# EasyEDA Pro project ProProject_aDataFlow_v2_pub_2024-01-13.epro, schematic SCH_front_1
Create Date: 2023-10-16; Page Name: P1; Project Name: aDataFlow_v2_pub; Schematic Name: SCH_front_1; Update Date: 2023-12-25; Company: AMAGSTY; Drawed: amagsty; Page Size: -; Part Number: -; Reviewed: -; Version: 2.51
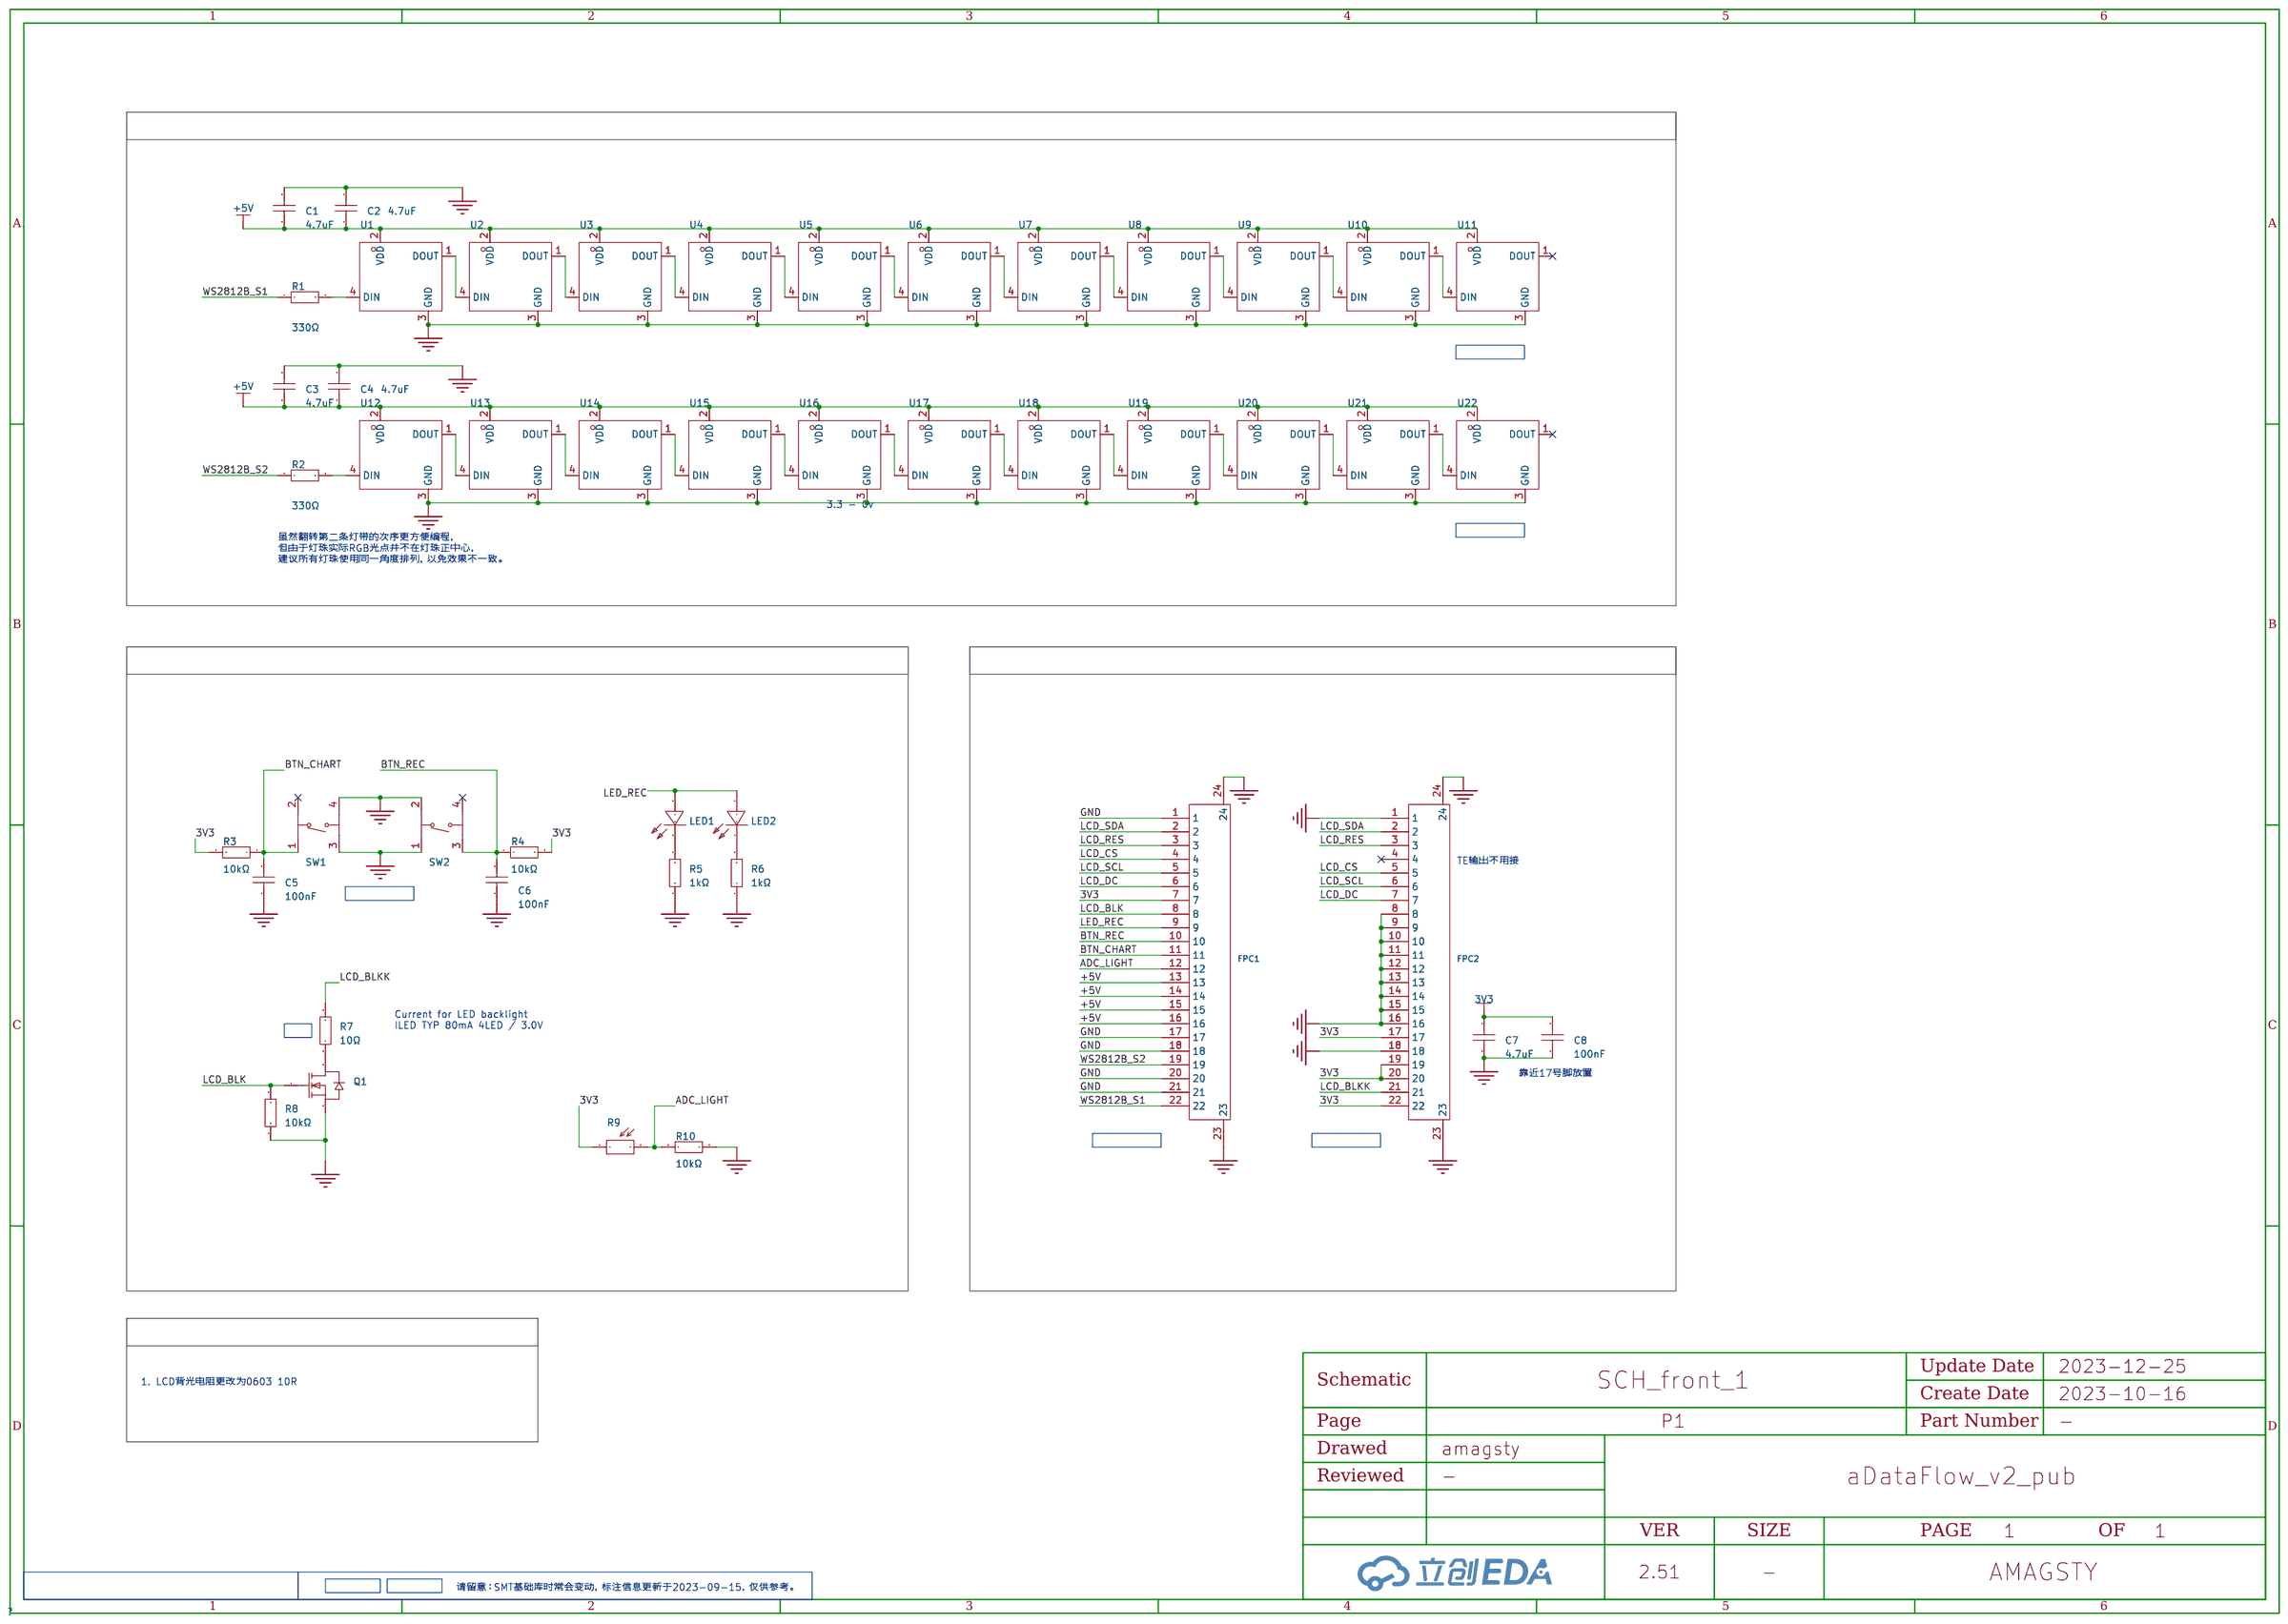
[diagram p4: schematic sheet]

## Parts
C1  4.7uF  [C0402]
C2  4.7uF  [C0402]
C3  4.7uF  [C0402]
C4  4.7uF  [C0402]
C5  100nF  [C0402]
C6  100nF  [C0402]
C7  4.7uF  [C0402]
C8  100nF  [C0402]
FPC1  AFC01-S22FCA-00  [FPC-SMD_P0.5-22P_FGS-XJ-H2.0]
FPC2  AFC01-S22FCA-00  [FPC-SMD_P0.5-22P_FGS-XJ-H2.0]
LED1  KT-0603R  [LED0603-RD]
LED2  KT-0603R  [LED0603-RD]
Q1  AO3400A  [SOT-23-3_L2.9-W1.6-P1.90-LS2.8-BR]
R1  330Ω  [R0402]
R2  330Ω  [R0402]
R3  10kΩ  [R0402]
R4  10kΩ  [R0402]
R5  1kΩ  [R0402]
R6  1kΩ  [R0402]
R7  10Ω  [R0603]
R8  10kΩ  [R0402]
R9  GT36516  [RES-SMD_L3.6-W2.4]
R10  10kΩ  [R0402]
SW1  TS-1187A-B-A-B  [SW-SMD_4P-L5.1-W5.1-P3.70-LS6.5-TL-2]
SW2  TS-1187A-B-A-B  [SW-SMD_4P-L5.1-W5.1-P3.70-LS6.5-TL-2]
U1  XL-1010RGBC-WS2812B  [LED-SMD_4P-L1.0-W1.0-TL_XL-1010RGBC-WS2812B]
U2  XL-1010RGBC-WS2812B  [LED-SMD_4P-L1.0-W1.0-TL_XL-1010RGBC-WS2812B]
U3  XL-1010RGBC-WS2812B  [LED-SMD_4P-L1.0-W1.0-TL_XL-1010RGBC-WS2812B]
U4  XL-1010RGBC-WS2812B  [LED-SMD_4P-L1.0-W1.0-TL_XL-1010RGBC-WS2812B]
U5  XL-1010RGBC-WS2812B  [LED-SMD_4P-L1.0-W1.0-TL_XL-1010RGBC-WS2812B]
U6  XL-1010RGBC-WS2812B  [LED-SMD_4P-L1.0-W1.0-TL_XL-1010RGBC-WS2812B]
U7  XL-1010RGBC-WS2812B  [LED-SMD_4P-L1.0-W1.0-TL_XL-1010RGBC-WS2812B]
U8  XL-1010RGBC-WS2812B  [LED-SMD_4P-L1.0-W1.0-TL_XL-1010RGBC-WS2812B]
U9  XL-1010RGBC-WS2812B  [LED-SMD_4P-L1.0-W1.0-TL_XL-1010RGBC-WS2812B]
U10  XL-1010RGBC-WS2812B  [LED-SMD_4P-L1.0-W1.0-TL_XL-1010RGBC-WS2812B]
U11  XL-1010RGBC-WS2812B  [LED-SMD_4P-L1.0-W1.0-TL_XL-1010RGBC-WS2812B]
U12  XL-1010RGBC-WS2812B  [LED-SMD_4P-L1.0-W1.0-TL_XL-1010RGBC-WS2812B]
U13  XL-1010RGBC-WS2812B  [LED-SMD_4P-L1.0-W1.0-TL_XL-1010RGBC-WS2812B]
U14  XL-1010RGBC-WS2812B  [LED-SMD_4P-L1.0-W1.0-TL_XL-1010RGBC-WS2812B]
U15  XL-1010RGBC-WS2812B  [LED-SMD_4P-L1.0-W1.0-TL_XL-1010RGBC-WS2812B]
U16  XL-1010RGBC-WS2812B  [LED-SMD_4P-L1.0-W1.0-TL_XL-1010RGBC-WS2812B]
U17  XL-1010RGBC-WS2812B  [LED-SMD_4P-L1.0-W1.0-TL_XL-1010RGBC-WS2812B]
U18  XL-1010RGBC-WS2812B  [LED-SMD_4P-L1.0-W1.0-TL_XL-1010RGBC-WS2812B]
U19  XL-1010RGBC-WS2812B  [LED-SMD_4P-L1.0-W1.0-TL_XL-1010RGBC-WS2812B]
U20  XL-1010RGBC-WS2812B  [LED-SMD_4P-L1.0-W1.0-TL_XL-1010RGBC-WS2812B]
U21  XL-1010RGBC-WS2812B  [LED-SMD_4P-L1.0-W1.0-TL_XL-1010RGBC-WS2812B]
U22  XL-1010RGBC-WS2812B  [LED-SMD_4P-L1.0-W1.0-TL_XL-1010RGBC-WS2812B]

## Library data of the parts
C1-C4 C7 = CL05A475MP5NRNC: 容值:4.7uF;精度:±20%;额定电压:10V;材质(温度系数):X5R;; LCSC Part Name: 4.7uF ±20% 10V; Supplier Part: C23733; Manufacturer: SAMSUNG(三星); Supplier Footprint: 0402; JLCPCB Part Class: 基础库; Datasheet: https://atta.szlcsc.com/upload/public/pdf/source/20160103/1457707710457.pdf; Supplier: LCSC; Tolerance: ±20%; Voltage Rated: 10V; Temperature Coefficient: X5R
C5 C6 C8 = CL05B104KO5NNNC: 容值:100nF;精度:±10%;额定电压:16V;材质(温度系数):X7R;; LCSC Part Name: 100nF ±10% 16V; Supplier Part: C1525; Manufacturer: SAMSUNG(三星); Supplier Footprint: 0402; JLCPCB Part Class: 基础库; Datasheet: https://atta.szlcsc.com/upload/public/pdf/source/20160103/1457707674891.pdf; Supplier: LCSC; Tolerance: ±10%; Voltage Rated: 16V; Temperature Coefficient: X7R
FPC1 FPC2 = AFC01-S22FCA-00: 间距:0.5mm;触点数量:22;锁定特性:翻盖式;安装类型:卧贴;触点类型:下接;; LCSC Part Name: FPC 0.5MM 22P 翻盖式 H2.0mm 下接; Supplier Part: C262668; Manufacturer: JS(钜硕电子); Supplier Footprint: P=0.5mm; JLCPCB Part Class: 扩展库; Supplier: LCSC; Pitch: 0.5mm; Number of Contacts: 22; Locking Feature: 翻盖式; Mounting Type: 卧贴; Contact Type: 下接; Height Above Board: 2mm; FFC, FCB Thickness: 0.3mm~0.3mm
LED1 LED2 = KT-0603R: 发光颜色:红灯;二极管配置:-;透镜颜色:-;主波长:-;色温:-;功率:-;发光角度:-;安装方式:-;工作温度:-40℃~+85℃;; LCSC Part Name: 0603 红灯 高亮; Supplier Part: C2286; Manufacturer: KENTO; Supplier Footprint: 0603; JLCPCB Part Class: 基础库; Datasheet: https://atta.szlcsc.com/upload/public/pdf/source/20160616/1466072038404.pdf; Supplier: LCSC; Emitted Color: 红灯; Operating Temperature: -40℃~+85℃
Q1 = AO3400A_C20917: 类型:N沟道;漏源电压(Vdss):30V;连续漏极电流(Id):5.7A;功率(Pd):1.4W;导通电阻(RDS(on)@Vgs,Id):26.5mΩ@10V,5.7A;; LCSC Part Name: N沟道 30V 5.7A; Supplier Part: C20917; Manufacturer: AOS; Supplier Footprint: SOT-23-3L; JLCPCB Part Class: Basic Part; Datasheet: https://atta.szlcsc.com/upload/public/pdf/source/20140107/1457706668533.pdf; Supplier: LCSC; Type: N沟道; Drain Source Voltage (Vdss): 30V; Continuous Drain Current (Id): 5.7A; Power Dissipation (Pd): 1.4W; Drain Source On Resistance (RDS(on)@Vgs,Id): 26.5mΩ@10V,5.7A; Gate Threshold Voltage (Vgs(th)@Id): 1.5V@250uA
R1 R2 = 0402WGF3300TCE: 电阻类型:厚膜电阻;阻值:330Ω;精度:±1%;功率:62.5mW;; LCSC Part Name: 330Ω ±1% 62.5mW; Supplier Part: C25104; Manufacturer: UNI-ROYAL(厚声); Supplier Footprint: 0402; JLCPCB Part Class: 基础库; Datasheet: https://atta.szlcsc.com/upload/public/pdf/source/20200306/C422600_1E6D84923E4A46A82E41ADD87F860B5C.pdf; Supplier: LCSC; Type: 厚膜电阻; Tolerance: ±1%; Power(Watts): 62.5mW; Temperature Coefficient: ±100ppm/℃; Overload Voltage (Max): 50V; Operating Temperature Range: -55℃~+155℃
R3 R4 R8 R10 = 0402WGF1002TCE: 电阻类型:厚膜电阻;阻值:10kΩ;精度:±1%;功率:62.5mW;; LCSC Part Name: 10kΩ ±1% 62.5mW; Supplier Part: C25744; Manufacturer: UNI-ROYAL(厚声); Supplier Footprint: 0402; JLCPCB Part Class: 基础库; Datasheet: https://atta.szlcsc.com/upload/public/pdf/source/20200306/C422600_1E6D84923E4A46A82E41ADD87F860B5C.pdf; Supplier: LCSC; Type: 厚膜电阻; Tolerance: ±1%; Power(Watts): 62.5mW; Temperature Coefficient: ±100ppm/℃; Overload Voltage (Max): 50V; Operating Temperature Range: -55℃~+155℃
R5 R6 = 0402WGF1001TCE: 电阻类型:厚膜电阻;阻值:1kΩ;精度:±1%;功率:62.5mW;; LCSC Part Name: 1kΩ ±1% 62.5mW; Supplier Part: C11702; Manufacturer: UNI-ROYAL(厚声); Supplier Footprint: 0402; JLCPCB Part Class: 基础库; Datasheet: https://atta.szlcsc.com/upload/public/pdf/source/20200306/C422600_1E6D84923E4A46A82E41ADD87F860B5C.pdf; Supplier: LCSC; Type: 厚膜电阻; Tolerance: ±1%; Power(Watts): 62.5mW; Temperature Coefficient: ±100ppm/℃; Overload Voltage (Max): 50V; Operating Temperature Range: -55℃~+155℃
R7 = 0603WAF100JT5E: 阻值:10Ω;精度:±1%;功率:100mW;温度系数:±400ppm/℃;电阻类型:厚膜电阻;; LCSC Part Name: 10Ω ±1% 100mW 厚膜电阻; Supplier Part: C22859; Manufacturer: UNI-ROYAL(厚声); Supplier Footprint: 0603; JLCPCB Part Class: 基础库; Datasheet: https://atta.szlcsc.com/upload/public/pdf/source/20200306/C422600_1E6D84923E4A46A82E41ADD87F860B5C.pdf; Supplier: LCSC; Tolerance: ±1%; Power(Watts): 100mW; Overload Voltage (Max): 75V; Temperature Coefficient: ±400ppm/℃; Type: 厚膜电阻; Operating Temperature Range: -55℃~+155℃
R9 = GT36516: 光敏电阻; Supplier Part: C2904880; Manufacturer: JCHL(晶创和立); Supplier Footprint: SMD,2.4x3.6mm; JLCPCB Part Class: Extended Part; Datasheet: https://atta.szlcsc.com/upload/public/pdf/source/20211015/E4E926A8609BA345C43880BD5DEBDBFD.pdf; Supplier: LCSC
SW1 SW2 = TS-1187A-B-A-B: 触点电流:50mA;额定电压(DC):12V;绝缘电阻:-;电路结构:单刀单掷;安装方式:立贴;带灯:无;作用力:160gf;机械寿命:10万次;带支架:否;; LCSC Part Name: 5.1*5.1*1.5mm 立贴 轻触开关 防水金属头; Supplier Part: C318884; Manufacturer: XKB Connectivity(中国星坤); Supplier Footprint: SMD; JLCPCB Part Class: 基础库; Datasheet: https://atta.szlcsc.com/upload/public/pdf/source/20200227/C318884_1F20165719E1C4CAA3E10C4C359C6E26.pdf; Supplier: LCSC; Contact Current: 50mA; Voltage Rating (DC): 12V; Circuit: 单刀单掷; Mounting Style: 立贴; Actuator Style: 圆形按钮; Actuator/Cap Color: 金色; With Lamp: 无; Operating Force: 160gf; Mechanical Life: 10万次; Operating Temperature: -30℃~+85℃; Switch Length: 5.1mm; Switch Width: 5.1mm; Switch Height: 1.5mm; Strike Gundam: 否
U1-U22 = XL-1010RGBC-WS2812B: 发光颜色:RGB三色;主波长:465nm~475nm；520nm~530nm；620nm~625nm;发光强度:300mcd；800mcd；200mcd;功率:-;安装方式:正贴;; LCSC Part Name: RGB三色 光强200mcd;800mcd;300mcd 正贴 0404幻彩; Supplier Part: C5349953; Manufacturer: XINGLIGHT(成兴光); Supplier Footprint: 1010; JLCPCB Part Class: 扩展库; Datasheet: https://atta.szlcsc.com/upload/public/pdf/source/20230111/7F92487BABF607E2EE42D1D66EFE1A21.pdf; Supplier: LCSC; Emitted Color: RGB三色; Lens Color: 无色透明; Dominant Wavelength: 465nm~475nm；520nm~530nm；620nm~625nm; Forward Current: 20mA; Forward Voltage (VF): 3.5V~5.5V; Luminous Intensity: 300mcd；800mcd；200mcd; Viewing Angle: 120°; Mounting Sytle: 正贴; Operating Temperature: -40℃~+150℃

## Nets
3V3: C7.2 C8.2 FPC1.7 FPC2.17 FPC2.19 FPC2.20 FPC2.22 R3.2 R4.2 R9.1
+5V: C1.1 C2.1 C3.1 C4.1 FPC1.13 FPC1.14 FPC1.15 FPC1.16 U1.2(VDD) U2.2(VDD) U3.2(VDD) U4.2(VDD) U5.2(VDD) U6.2(VDD) U7.2(VDD) U8.2(VDD) U9.2(VDD) U10.2(VDD) U11.2(VDD) U12.2(VDD) U13.2(VDD) U14.2(VDD) U15.2(VDD) U16.2(VDD) U17.2(VDD) U18.2(VDD) U19.2(VDD) U20.2(VDD) U21.2(VDD) U22.2(VDD)
GND: C1.2 C2.2 C3.2 C4.2 C5.2 C6.2 C7.1 C8.1 FPC1.1 FPC1.17 FPC1.18 FPC1.20 FPC1.21 FPC1.23 FPC1.24 FPC2.1 FPC2.8 FPC2.9 FPC2.10 FPC2.11 FPC2.12 FPC2.13 FPC2.14 FPC2.15 FPC2.16 FPC2.18 FPC2.23 FPC2.24 Q1.2(S) R5.1 R6.1 R8.2 R10.1 SW1.3(C) SW1.4(D) SW2.1(A) SW2.2(B) U1.3(GND) U2.3(GND) U3.3(GND) U4.3(GND) U5.3(GND) U6.3(GND) U7.3(GND) U8.3(GND) U9.3(GND) U10.3(GND) U11.3(GND) U12.3(GND) U13.3(GND) U14.3(GND) U15.3(GND) U16.3(GND) U17.3(GND) U18.3(GND) U19.3(GND) U20.3(GND) U21.3(GND) U22.3(GND)
ADC_LIGHT: FPC1.12 R9.2 R10.2
BTN_CHART: C5.1 FPC1.11 R3.1 SW1.1(A)
BTN_REC: C6.1 FPC1.10 R4.1 SW2.3(C)
LCD_BLK: FPC1.8 Q1.1(G) R8.1
LCD_BLKK: FPC2.21 R7.2
LCD_CS: FPC1.4 FPC2.5
LCD_DC: FPC1.6 FPC2.7
LCD_RES: FPC1.3 FPC2.3
LCD_SCL: FPC1.5 FPC2.6
LCD_SDA: FPC1.2 FPC2.2
LED_REC: FPC1.9 LED1.2(A) LED2.2(A)
WS2812B_S1: FPC1.22 R1.1
WS2812B_S2: FPC1.19 R2.1
$1N953: U1.1(DOUT) U2.4(DIN)
$1N956: U2.1(DOUT) U3.4(DIN)
$1N959: U3.1(DOUT) U4.4(DIN)
$1N1148: U5.1(DOUT) U6.4(DIN)
$1N1150: U6.1(DOUT) U7.4(DIN)
$1N1152: U7.1(DOUT) U8.4(DIN)
$1N1342: U9.1(DOUT) U10.4(DIN)
$1N1344: U10.1(DOUT) U11.4(DIN)
$1N1350: U4.1(DOUT) U5.4(DIN)
$1N1353: U8.1(DOUT) U9.4(DIN)
$1N1918: U12.1(DOUT) U13.4(DIN)
$1N1920: U13.1(DOUT) U14.4(DIN)
$1N1922: U14.1(DOUT) U15.4(DIN)
$1N1924: U16.1(DOUT) U17.4(DIN)
$1N1926: U17.1(DOUT) U18.4(DIN)
$1N1928: U18.1(DOUT) U19.4(DIN)
$1N1930: U20.1(DOUT) U21.4(DIN)
$1N1932: U21.1(DOUT) U22.4(DIN)
$1N1936: U15.1(DOUT) U16.4(DIN)
$1N1938: U19.1(DOUT) U20.4(DIN)
$1N16042: LED1.1(K) R5.2
$1N16085: LED2.1(K) R6.2
$1N17559: R1.2 U1.4(DIN)
$1N17604: R2.2 U12.4(DIN)
$1N26288: Q1.3(D) R7.1

Not connected (* = marked no-connect by the designer): FPC2 4*; SW1 2(B)*; SW2 4(D)*; U11 1(DOUT)*; U22 1(DOUT)*

## Notes on the sheet
- RGB
- SMT_EXT
- 3.3 - 0v
- SMT_EXT
- 虽然翻转第二条灯带的次序更方便编程，
  但由于灯珠实际RGB光点并不在灯珠正中心，
  建议所有灯珠使用同一角度排列，以免效果不一致。
- MISC
- FPC
- TE输出不用接
- SMT_BASE
- NEW
- Current for LED backlight
  ILED TYP 80mA 4LED / 3.0V
- 靠近17号脚放置
- SMT_EXT
- SMT_EXT
- UPDATE REV. 2.51
- 1. LCD背光电阻更改为0603 10R
- SMT_BASE
- SMT_EXT
- PCB: 黑色，1.0mm
- 请留意：SMT基础库时常会变动，标注信息更新于2023-09-15，仅供参考。
